# EAGLE design WirelessPowerRxExtensionBoard (EAGLE 6.4)

## Sheet 1 of 2
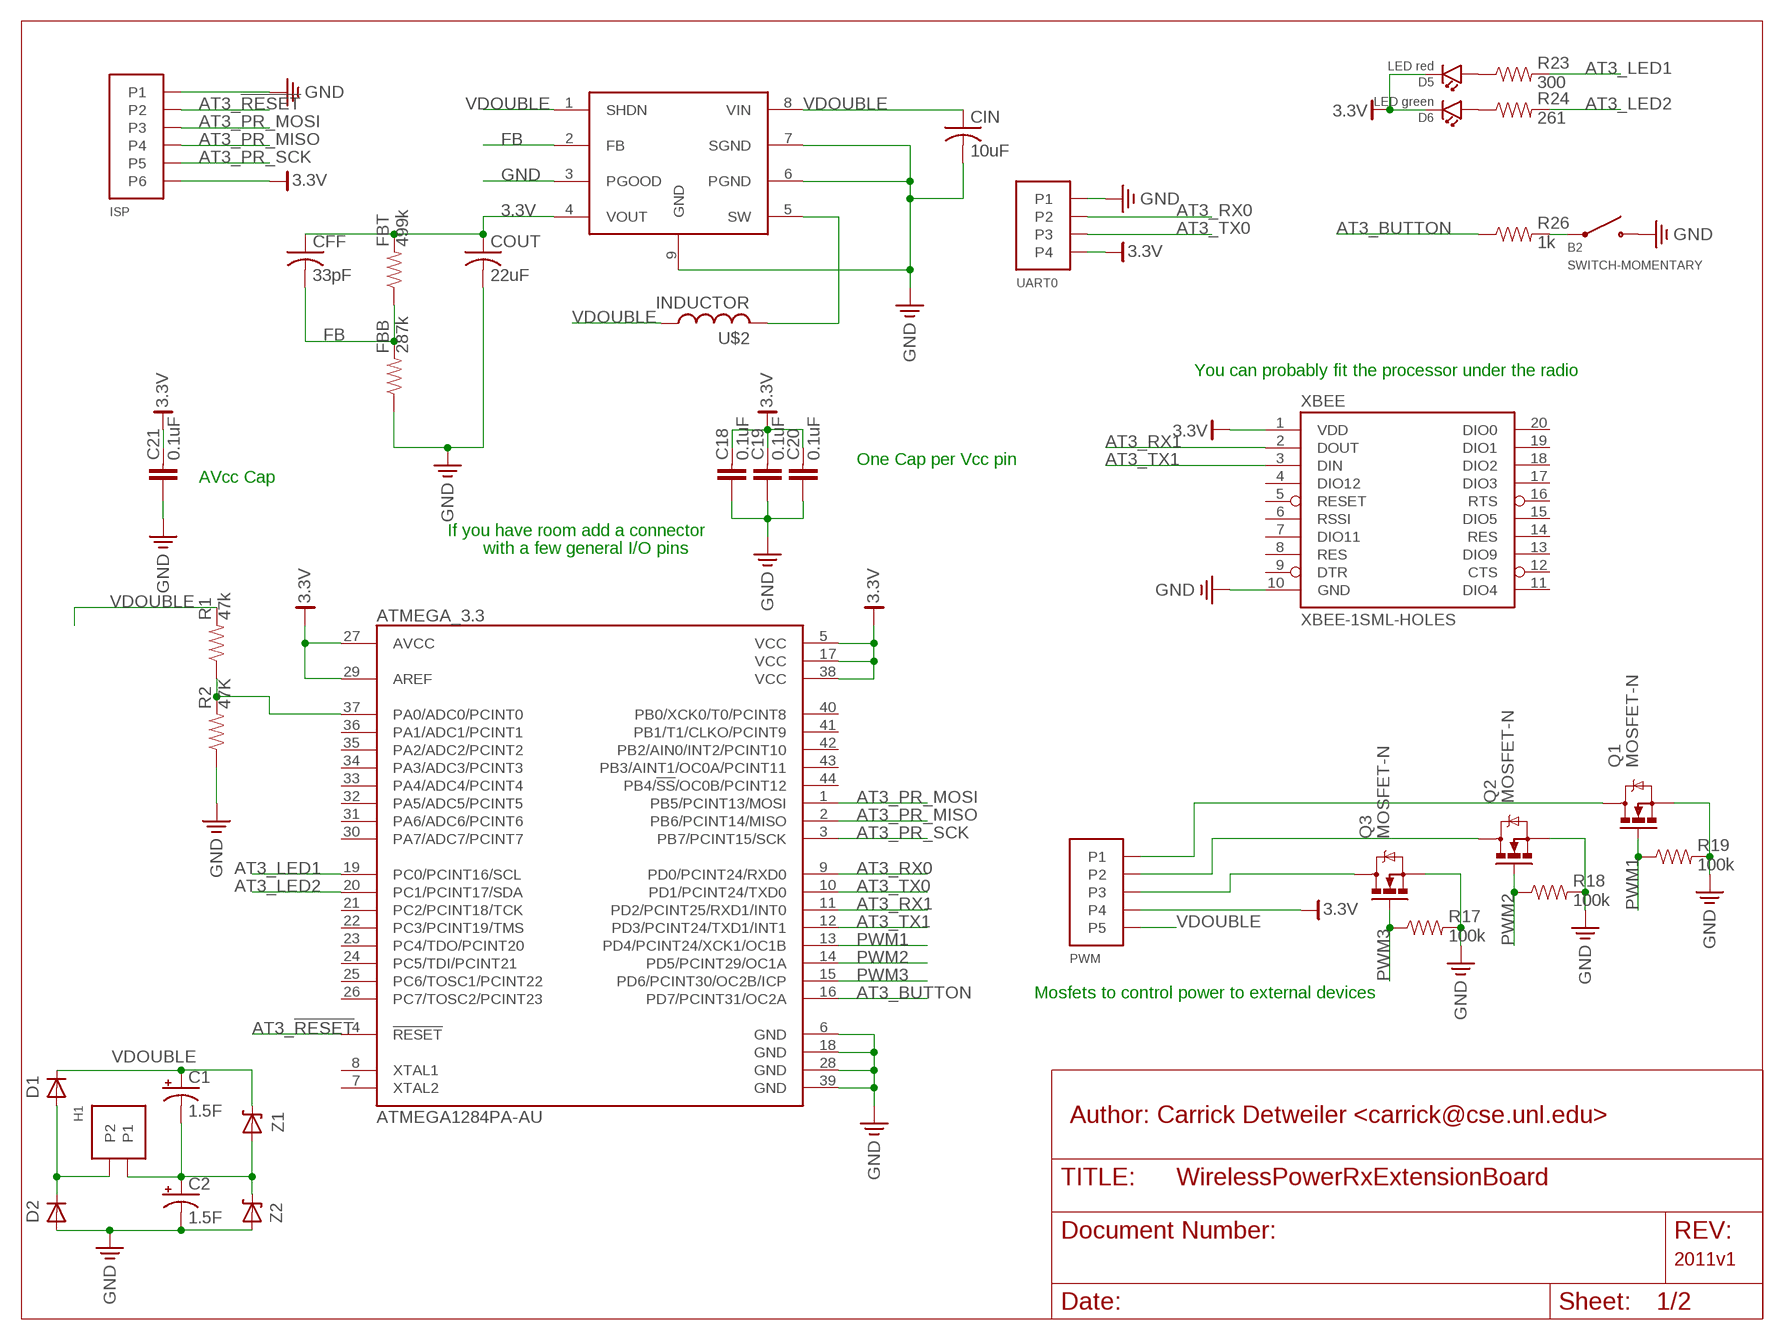
[diagram p0: schematic, sheet 1]

### Parts
ATMEGA_3.3  ATMEGA1284PA-AU  ATMEGA164PA-AU  [AT_TQFP-44]
B2  SWITCH-MOMENTARY  [SWITCH-MOMENTARY-PTS635-SMD]
C1  1.5F  CPOL-USE5-10.5  [E5-10,5]
C2  1.5F  CPOL-USE5-10.5  [E5-10,5]
C18  0.1uF  CAP0603  [C0603]
C19  0.1uF  CAP0603  [C0603]
C20  0.1uF  CAP0603  [C0603]
C21  0.1uF  CAP0603  [C0603]
CFF  33pF  C-USC0201  [C0201]
CIN  10uF  C-USC0805  [C0805]
COUT  22uF  C-USC0805  [C0805]
D1  DIODE  [DO-214AB]
D2  DIODE  [DO-214AB]
D5  LED red  LED  [LED0603]
D6  LED green  LED  [LED0603]
FBB  287k  RES0603  [R0603]
FBT  499k  RES0603  [R0603]
H1  DF3-2  [DF3-2]
ISP  DF3-6  [DF3-6]
PWM  DF3-5  [DF3-5]
Q1  MOSFET-N  [SOT-23]
Q2  MOSFET-N  [SOT-23]
Q3  MOSFET-N  [SOT-23]
R1  47k  RES0603  [R0603]
R2  47K  RES0603  [R0603]
R17  100k  RES0603  [R0603]
R18  100k  RES0603  [R0603]
R19  100k  RES0603  [R0603]
R23  300  RES0603  [R0603]
R24  261  RES0603  [R0603]
R26  1k  RES0603  [R0603]
U$1  STEPUPCONVERTER  [LTC3528/LTC3528B]
U$2  INDUCTOR  [WE-TPC-M]
UART0  DF3-4  [DF3-4]
XBEE  XBEE-1SML-HOLES  [XBEE-SML-HOLES]
Z1  ZENERDIODE  [SOD-123]
Z2  ZENERDIODE  [SOD-123]

### Nets
3.3V: ATMEGA_3.3.5(VCC) ATMEGA_3.3.17(VCC) ATMEGA_3.3.27(AVCC) ATMEGA_3.3.29(AREF) ATMEGA_3.3.38(VCC) C18.P$2 C19.P$2 C20.P$2 C21.P$2 CFF.1 COUT.1 D5.P$2 D6.P$2 FBT.P$2 ISP.P$6(P6) PWM.P$4(P4) U$1.4(VOUT) UART0.P$4(P4) XBEE.1(VDD)
AT3_!RESET!: ATMEGA_3.3.4(!RESET!) ISP.P$2(P2)
AT3_BUTTON: ATMEGA_3.3.16(PD7/PCINT31/OC2A) R26.P$1
AT3_LED1: ATMEGA_3.3.19(PC0/PCINT16/SCL) R23.P$2
AT3_LED2: ATMEGA_3.3.20(PC1/PCINT17/SDA) R24.P$2
AT3_PR_MISO: ATMEGA_3.3.2(PB6/PCINT14/MISO) ISP.P$4(P4)
AT3_PR_MOSI: ATMEGA_3.3.1(PB5/PCINT13/MOSI) ISP.P$3(P3)
AT3_PR_SCK: ATMEGA_3.3.3(PB7/PCINT15/SCK) ISP.P$5(P5)
AT3_RX0: ATMEGA_3.3.9(PD0/PCINT24/RXD0) UART0.P$2(P2)
AT3_RX1: ATMEGA_3.3.11(PD2/PCINT25/RXD1/INT0) XBEE.2(DOUT)
AT3_TX0: ATMEGA_3.3.10(PD1/PCINT24/TXD0) UART0.P$3(P3)
AT3_TX1: ATMEGA_3.3.12(PD3/PCINT24/TXD1/INT1) XBEE.3(DIN)
FB: CFF.2 FBB.P$2 FBT.P$1 U$1.2(FB)
GND: ATMEGA_3.3.6(GND) ATMEGA_3.3.18(GND) ATMEGA_3.3.28(GND) ATMEGA_3.3.39(GND) B2.P$2 C2.- C18.P$1 C19.P$1 C20.P$1 C21.P$1 CIN.2 COUT.2 D2.P$2(A) FBB.P$1 ISP.P$1(P1) Q1.2(S) Q2.2(S) Q3.2(S) R2.P$1 R17.P$2 R18.P$2 R19.P$2 U$1.3(PGOOD) U$1.6(PGND) U$1.7(SGND) U$1.9(GND) UART0.P$1(P1) XBEE.10(GND) Z2.P$2(A)
N$1: D1.P$2(A) D2.P$1(C) H1.P$2(P2)
N$3: ATMEGA_3.3.37(PA0/ADC0/PCINT0) R1.P$1 R2.P$2
N$4: C1.- C2.+ H1.P$1(P1) Z1.P$2(A) Z2.P$1(C)
N$20: PWM.P$3(P3) Q3.3(D)
N$22: PWM.P$2(P2) Q2.3(D)
N$23: B2.P$1 R26.P$2
N$24: PWM.P$1(P1) Q1.3(D)
N$38: D5.P$1 R23.P$1
N$39: D6.P$1 R24.P$1
PWM1: ATMEGA_3.3.13(PD4/PCINT24/XCK1/OC1B) Q1.1(G) R19.P$1
PWM2: ATMEGA_3.3.14(PD5/PCINT29/OC1A) Q2.1(G) R18.P$1
PWM3: ATMEGA_3.3.15(PD6/PCINT30/OC2B/ICP) Q3.1(G) R17.P$1
SW: U$1.5(SW) U$2.P$2
VDOUBLE: C1.+ CIN.1 D1.P$1(C) PWM.P$5(P5) R1.P$2 U$1.1(SHDN) U$1.8(VIN) U$2.P$1 Z1.P$1(C)
Unconnected: ATMEGA_3.3.7(XTAL2) ATMEGA_3.3.8(XTAL1) ATMEGA_3.3.21(PC2/PCINT18/TCK) ATMEGA_3.3.22(PC3/PCINT19/TMS) ATMEGA_3.3.23(PC4/TDO/PCINT20) ATMEGA_3.3.24(PC5/TDI/PCINT21) ATMEGA_3.3.25(PC6/TOSC1/PCINT22) ATMEGA_3.3.26(PC7/TOSC2/PCINT23) ATMEGA_3.3.30(PA7/ADC7/PCINT7) ATMEGA_3.3.31(PA6/ADC6/PCINT6) ATMEGA_3.3.32(PA5/ADC5/PCINT5) ATMEGA_3.3.33(PA4/ADC4/PCINT4) ATMEGA_3.3.34(PA3/ADC3/PCINT3) ATMEGA_3.3.35(PA2/ADC2/PCINT2) ATMEGA_3.3.36(PA1/ADC1/PCINT1) ATMEGA_3.3.40(PB0/XCK0/T0/PCINT8) ATMEGA_3.3.41(PB1/T1/CLKO/PCINT9) ATMEGA_3.3.42(PB2/AIN0/INT2/PCINT10) ATMEGA_3.3.43(PB3/AINT1/OC0A/PCINT11) ATMEGA_3.3.44(PB4/!SS!/OC0B/PCINT12) XBEE.4(DIO12) XBEE.5(RESET) XBEE.6(RSSI) XBEE.7(DIO11) XBEE.8(RES) XBEE.9(DTR) XBEE.11(DIO4) XBEE.12(CTS) XBEE.13(DIO9) XBEE.14(RES) XBEE.15(DIO5) XBEE.16(RTS) XBEE.17(DIO3) XBEE.18(DIO2) XBEE.19(DIO1) XBEE.20(DIO0)

### Notes on the sheet
- You can probably fit the processor under the radio
- One Cap per Vcc pin
- AVcc Cap
- If you have room add a connector
- with a few general I/O pins
- Mosfets to control power to external devices
- Author: Carrick Detweiler <carrick@cse.unl.edu>
- 2011v1

## Sheet 2 of 2
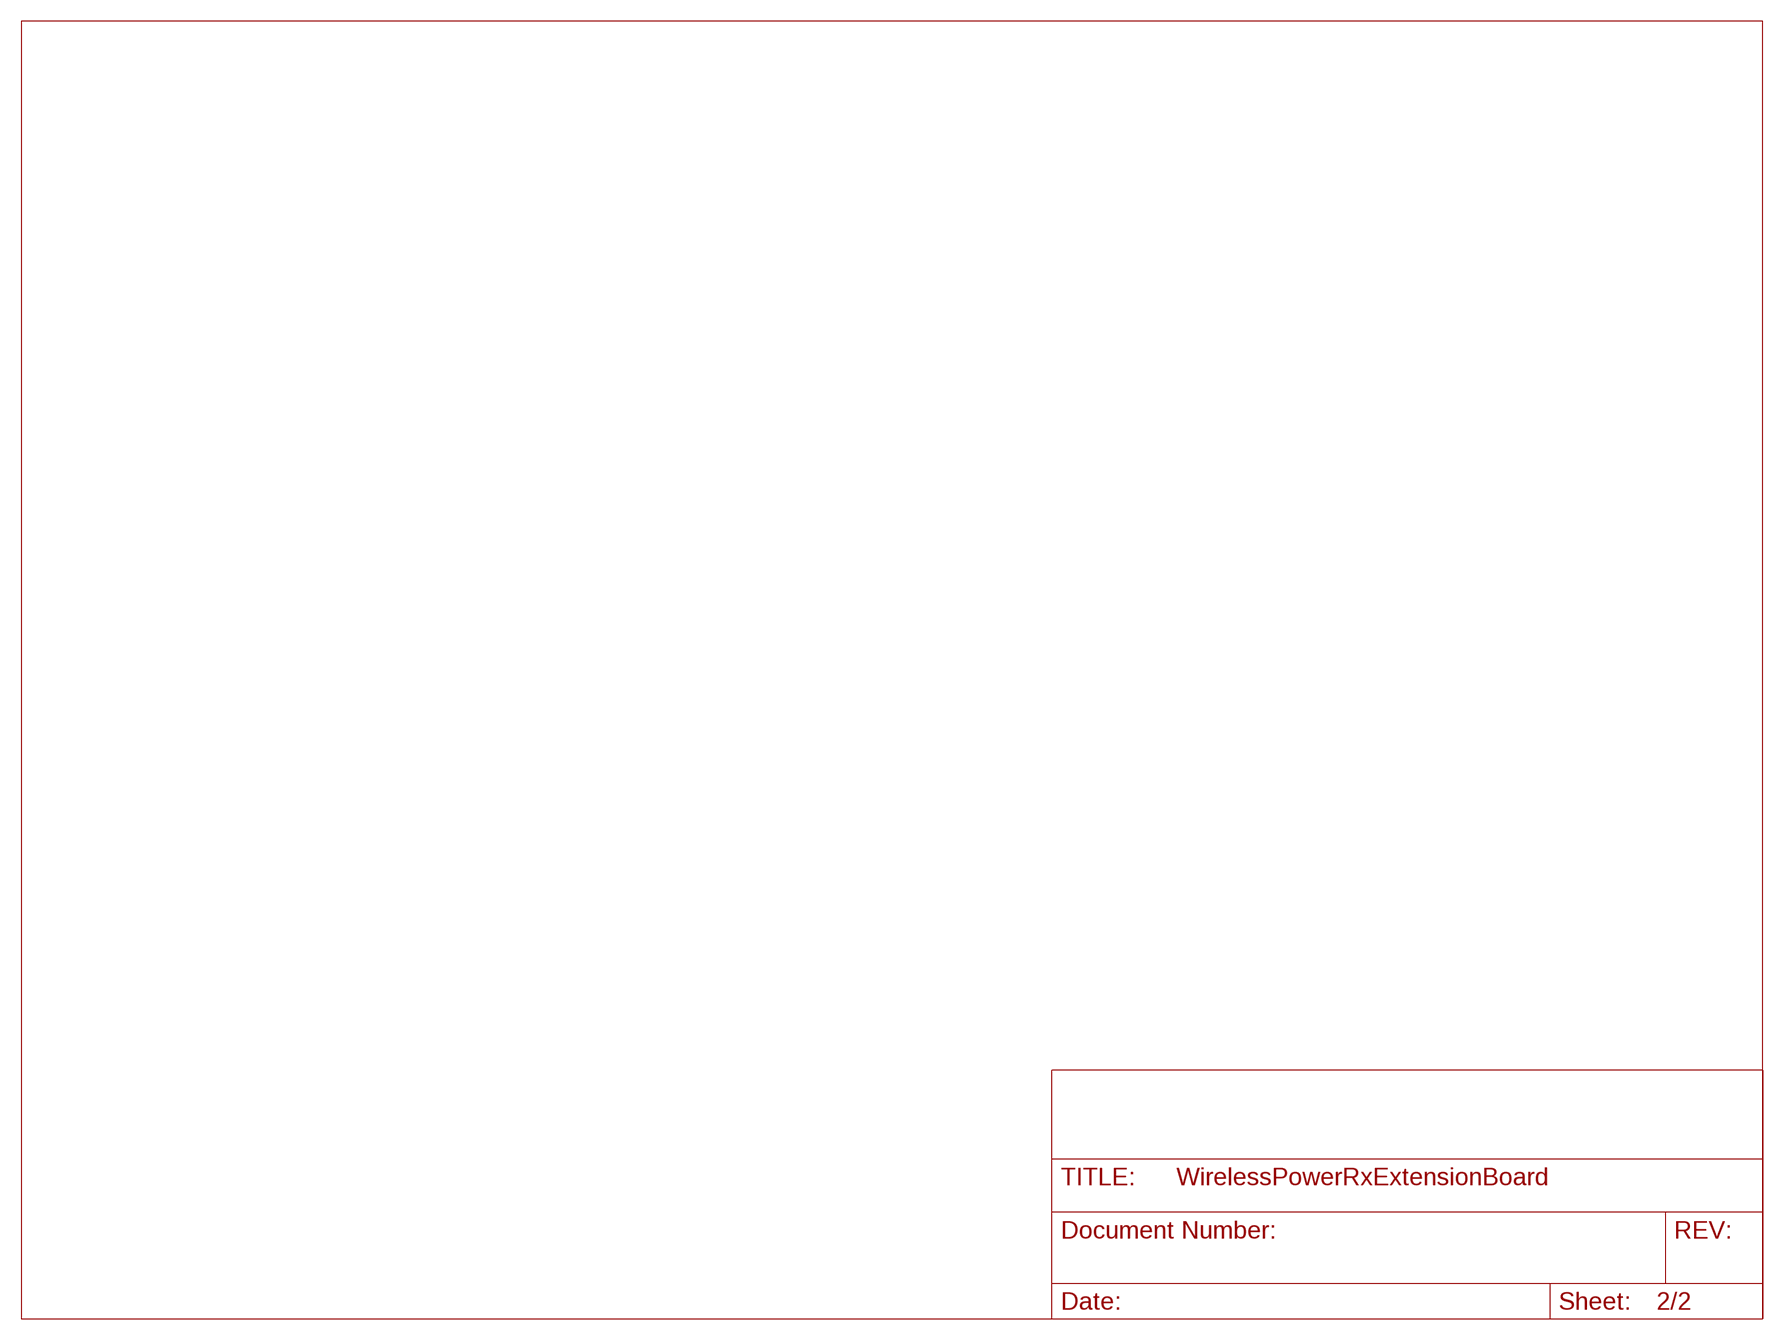
[diagram p1: schematic, sheet 2]

## Library data of the parts
ATMEGA_3.3 = kwgilpin:ATMEGA164: 8-bit AVR Microcontroller with 16K Flash; DIGIKEYPN: ATMEGA164P-20AU-ND; VENDOR: Digikey; VENDORPN: ATMEGA164P-20AU-ND
B2 = 000_carrick:SWITCH-MOMENTARY
C1 C2 = resistor:CPOL-US: POLARIZED CAPACITOR, American symbol
C18-C21 = carrick:CAP: Surface mount capacitor, non-polarized
CFF CIN COUT = rcl:C-US: CAPACITOR, American symbol
D1 D2 = crawford:DIODE: Diode SSC54-E3/57T SCHOTTKY 5A 40V package DO-214AB
D5 = 000_carrick:LED: LED; DIGIKEY: 160-1181-1-ND
D6 = 000_carrick:LED: LED; DIGIKEY: 160-1435-1-ND
FBB FBT R1 R2 R17-R19 = carrick:RES: Resistor
H1 = hirose:DF3-2
ISP = hirose:DF3-6
PWM = hirose:DF3-5
Q1-Q3 = carrick:MOSFET-N: N-Channel MOSFET 0.22A, 50V, few ohm resistance, can be driven at 3.3V Digikey parts: BSS138 BSS138CT-ND
R23 R24 R26 = 000_carrick:RES: Resistor
U$1 = crawford:STEPUPCONVERTER: LTC3528/LTC2528B 1A 1MHz Synchronous Step-Up DC/DC Converters in 3mm x 2mm DFN Manufacturer: Linear Technology
U$2 = crawford:INDUCTOR: Manufacturer: Wurth Value: 3.0uH Current Rating: 2.2A DC Resistance: 45 mOhm Package: 2323 (SMC) Manufacturer part no. : 744052003 Digikey Part Number: 732-1029-1-ND
UART0 = hirose:DF3-4
XBEE = carrick:XBEE-1
Z1 Z2 = crawford:ZENERDIODE

## Board
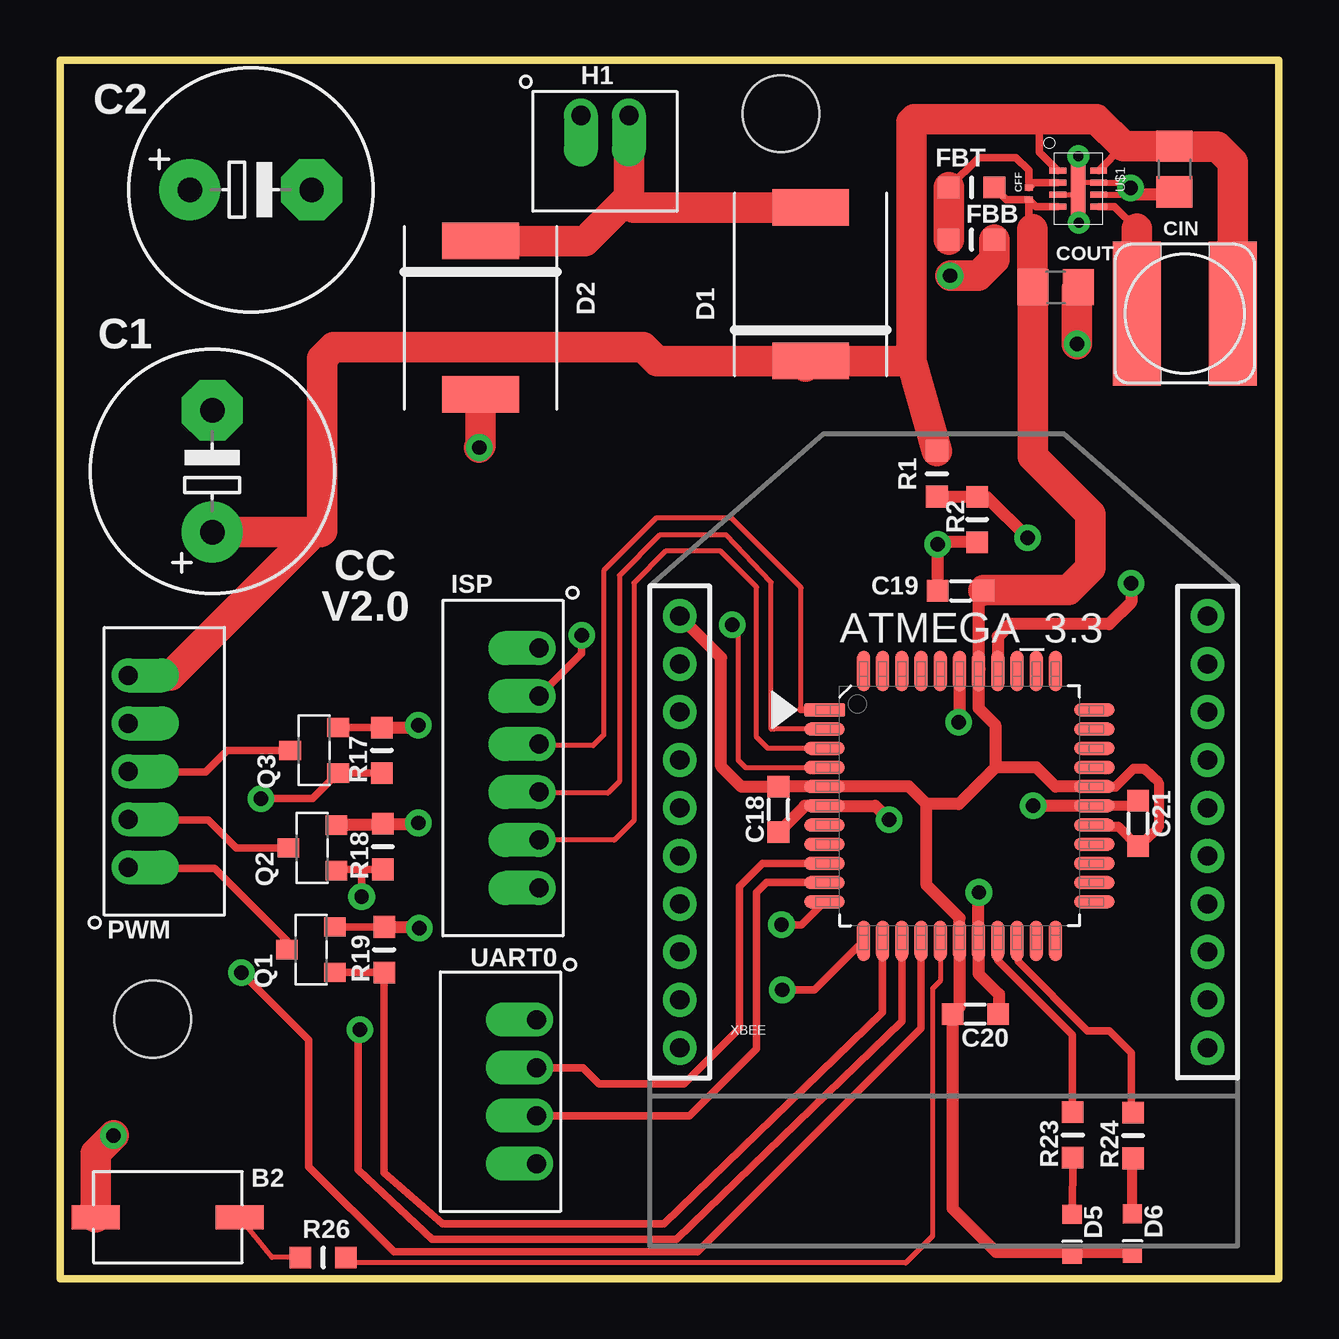
[diagram p2: board, top side]
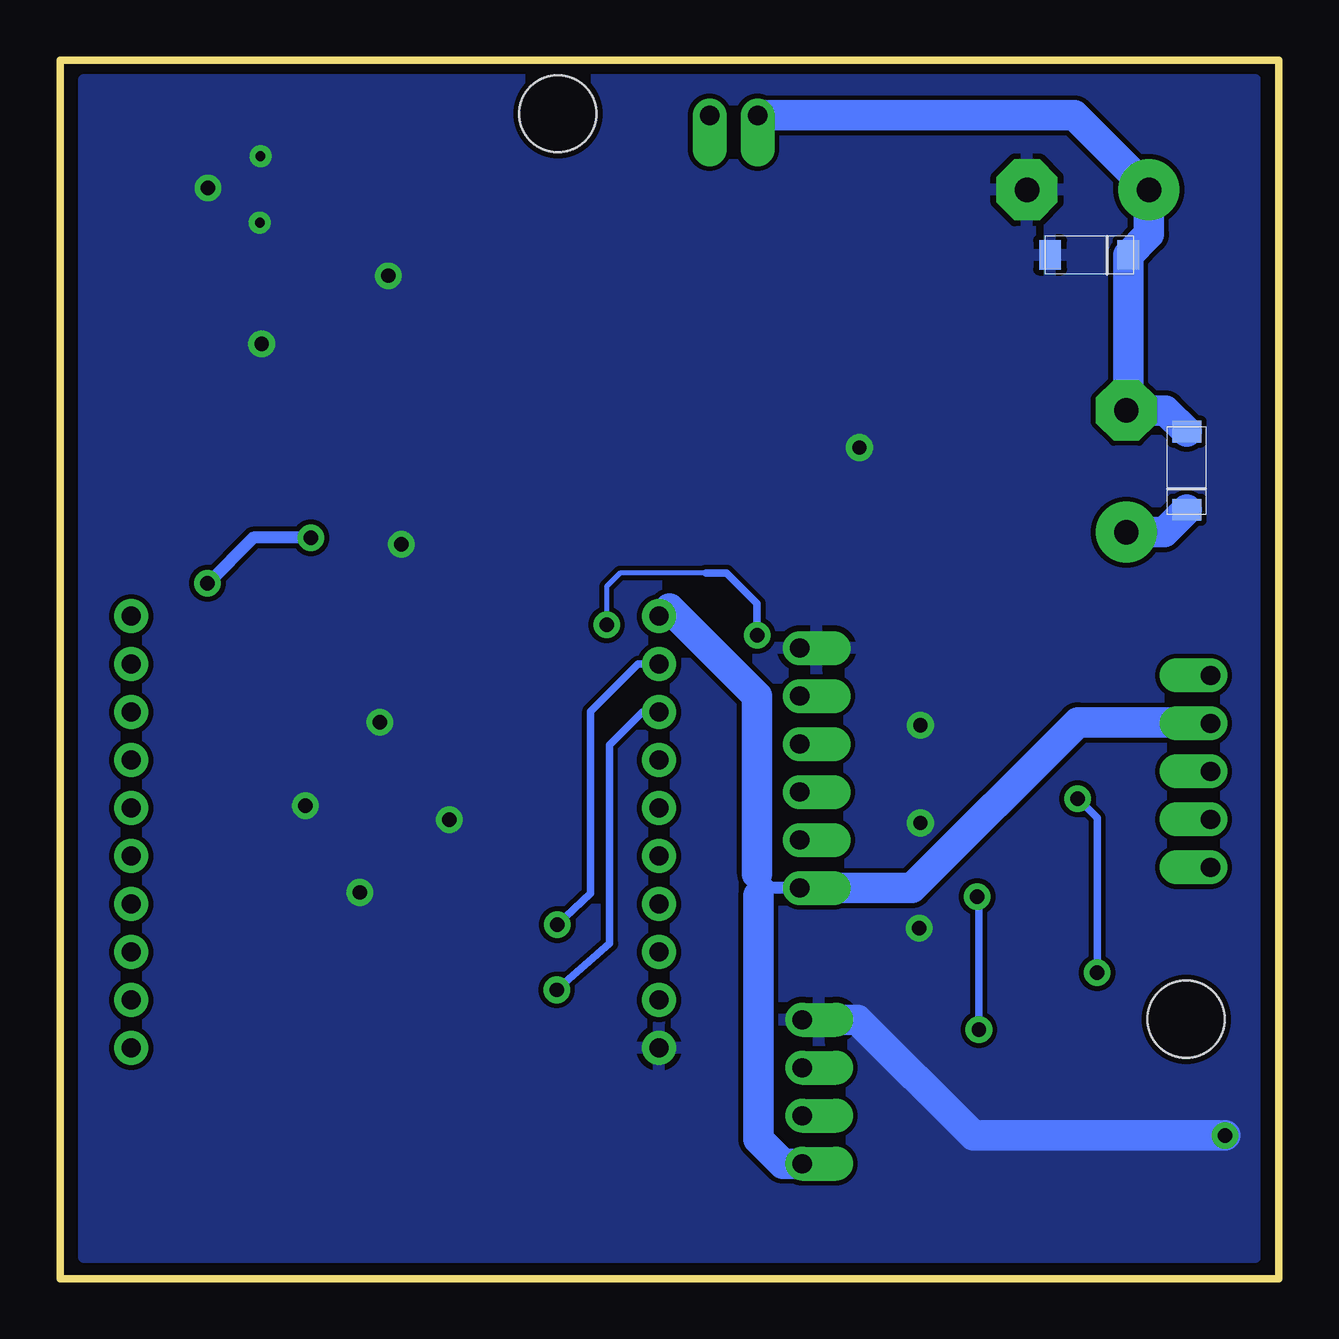
[diagram p3: board, bottom side, seen from below]

Size 50.8 x 50.8 mm. Coordinates in mm from the lower left corner, seen from the top.
Outline: 0,0 50.8,0 50.8,50.8 0,50.8 0,0
Copper layers (1*16): Top 0.035mm / dielectric 1.5mm / Bottom 0.035mm
Design rules "SparkFun": minimum track width 8mil, minimum drill 20mil, track to track 8mil, track to pad 8mil, pad to pad 8mil, via to via 8mil, smd to smd 8mil, copper to edge 10mil, drill to drill 8mil, minimum pad ring 12mil, minimum via ring 10mil, stop-mask expansion 4mil, vias tented up to drill 25mil, thermal gap 10mil
Holes 3.2 mm at 30.05,48.56 3.86,10.82

### Footprints (pad centres in the part's own frame; a part is rotated, then mirrored left to right if it is on the bottom)
AT_TQFP-44 = smd 1.7 x 0.55: 1 -5.625,4; 2 -5.625,3.2; 3 -5.625,2.4; 4 -5.625,1.6; 5 -5.625,0.8; 6 -5.625,0; 7 -5.625,-0.8; 8 -5.625,-1.6; 9 -5.625,-2.4; 10 -5.625,-3.2; 11 -5.625,-4; 23 5.625,-4; 24 5.625,-3.2; 25 5.625,-2.4; 26 5.625,-1.6; 27 5.625,-0.8; 28 5.625,0; 29 5.625,0.8; 30 5.625,1.6; 31 5.625,2.4; 32 5.625,3.2; 33 5.625,4 | smd 0.55 x 1.7: 12 -4,-5.625; 13 -3.2,-5.625; 14 -2.4,-5.625; 15 -1.6,-5.625; 16 -0.8,-5.625; 17 0,-5.625; 18 0.8,-5.625; 19 1.6,-5.625; 20 2.4,-5.625; 21 3.2,-5.625; 22 4,-5.625; 34 4,5.625; 35 3.2,5.625; 36 2.4,5.625; 37 1.6,5.625; 38 0.8,5.625; 39 0,5.625; 40 -0.8,5.625; 41 -1.6,5.625; 42 -2.4,5.625; 43 -3.2,5.625; 44 -4,5.625
SWITCH-MOMENTARY-PTS635-SMD = smd 2 x 1: P$1 -3,0; P$2 3,0
E5-10,5 = drill 1.016 pad 2.54: + -2.54,0 | drill 1.016 pad 2.54 octagon: - 2.54,0
C0603 = smd 0.9 x 0.9: P$1 -0.95,0; P$2 0.95,0
C0201 = smd 0.25 x 0.35: 1 -0.25,0; 2 0.25,0
C0805 = smd 1.3 x 1.5: 1 -0.95,0; 2 0.95,0
DO-214AB = smd 1.524 x 3.2: P$1 -3.2,0; P$2 3.2,0
LED0603 = smd 0.8 x 0.8: P$1 -0.825,0; P$2 0.825,0
R0603 = smd 0.9 x 0.9: P$1 -0.95,0; P$2 0.95,0
DF3-2 = drill 0.8 offset: P$1 0,0; P$2 -2,0
DF3-6 = drill 0.8 offset: P$1 0,0; P$2 -2,0; P$3 -4,0; P$4 -6,0; P$5 -8,0; P$6 -10,0
DF3-5 = drill 0.8 offset: P$1 0,0; P$2 -2,0; P$3 -4,0; P$4 -6,0; P$5 -8,0
SOT-23 = smd 0.8 x 0.9: 1 -0.95,-1; 2 0.95,-1; 3 0,1
LTC3528/LTC3528B = smd 0.25 x 0.7: 1 -0.75,-0.85; 2 -0.25,-0.85; 3 0.25,-0.85; 4 0.75,-0.85; 5 0.75,0.85; 6 0.25,0.85; 7 -0.25,0.85; 8 -0.75,0.85 | smd 2.2 x 0.61: 9 0,0
WE-TPC-M = smd 6 x 2: P$1 0,2; P$2 0,-2
DF3-4 = drill 0.8 offset: P$1 0,0; P$2 -2,0; P$3 -4,0; P$4 -6,0
XBEE-SML-HOLES = drill 0.8 pad 1.27: 1 -9.73,20; 2 -9.73,18; 3 -9.73,16; 4 -9.73,14; 5 -9.73,12; 6 -9.73,10; 7 -9.73,8; 8 -9.73,6; 9 -9.73,4; 10 -9.73,2; 11 12.27,2; 12 12.27,4; 13 12.27,6; 14 12.27,8; 15 12.27,10; 16 12.27,12; 17 12.27,14; 18 12.27,16; 19 12.27,18; 20 12.27,20
SOD-123 = smd 0.91 x 1.22: P$1 -1.63,0; P$2 1.63,0

### Placement (x,y rotation side)
ATMEGA_3.3  37.49,19.71 0 top
B2  4.5,2.57 180 top
C1  6.35,33.66 90 top
C2  7.95,45.39 0 top
C18  29.95,19.56 90 top
C19  37.54,28.68 0 top
C20  38.15,11.02 180 top
C21  44.93,18.97 270 top
CFF  40.39,45.24 90 top
CIN  46.46,46.25 270 top
COUT  41.5,41.33 0 top
D1  31.29,41.45 90 top
D2  17.53,40.06 270 top
D5  42.19,1.85 270 top
D6  44.7,1.88 270 top
FBB  38,43.31 180 top
FBT  38,45.49 0 top
H1  21.72,48.49 180 top
ISP  19.96,26.29 90 top
PWM  2.84,17.14 270 top
Q1  10.46,13.72 90 top
Q2  10.52,17.96 90 top
Q3  10.59,22.02 90 top
R1  36.55,33.55 90 top
R2  38.23,31.65 90 top
R17  13.41,22.02 90 top
R18  13.46,18.01 90 top
R19  13.51,13.72 90 top
R23  42.21,5.99 90 top
R24  44.73,5.97 90 top
R26  10.97,0.89 180 top
U$1  42.44,45.44 270 top
U$2  46.89,40.23 270 top
UART0  19.86,10.79 90 top
XBEE  35.56,7.62 0 top
Z1  3.84,33.68 90 bottom
Z2  7.9,42.67 180 bottom

### Tracks (layer width: path | path; a pad name or v marks a point on that pad's centre or on a via)
3.3V
  Top 0.305: CFF.1 40.68,44.69 U$1.4 | 40.54,43.74 40.39,43.89 CFF.1 | FBT.P$2 39.45,44.99 CFF.1
  Top 0.406: ATMEGA_3.3.29 44.01,20.51 44.76,21.26 45.19,21.26 45.8,20.68 45.8,18.81 C21.P$2 44.11,18.85 43.16,18.85 43.16,18.87 ATMEGA_3.3.27 | D6.P$2 42.22,1.05 D5.P$2
  Top 0.508: 38.33,25.4 ATMEGA_3.3.38 | XBEE.1 27.56,25.89 27.56,21.36 28.41,20.51 C18.P$2 ATMEGA_3.3.5 31.88,20.52 35.38,20.52 36.12,19.79 | 36.12,19.79 36.12,16.41 37.49,15.04 ATMEGA_3.3.17 37.49,11.31 C20.P$2 37.2,2.93 39.01,1.12 42.1,1.12 D5.P$2 | ATMEGA_3.3.38 38.29,23.79 38.99,23.09 38.99,21.31 | 38.99,21.31 37.47,19.79 36.12,19.79 | ATMEGA_3.3.29 41.49,20.51 40.69,21.31 38.99,21.31 | ATMEGA_3.3.38 38.29,28.48 C19.P$2 38.52,28.65 38.58,28.65
  Top 1.27: C19.P$2 38.52,28.7 42.04,28.7 42.95,29.62 42.95,31.88 40.55,34.27 COUT.1 40.54,41.34 40.54,43.74
  Bottom 0.203: 25.4,27.94 XBEE.1
  Bottom 0.508: 2.89,23.19 PWM.P$4 | ISP.P$6 21.17,16.29 21.27,16.4 | 21.27,16.4 21.74,16.87 | 21.69,15.98 21.27,16.4
  Bottom 1.27: ISP.P$6 15.28,16.29 8.38,23.19 2.89,23.19 | 21.74,16.87 21.74,24.28 25.4,27.94 | UART0.P$4 20.67,4.79 21.69,5.82 21.69,15.98
AT3_!RESET!  (via drill 0.6 pad 0.3)
  Top 0.203: v28.02,27.25 28.27,27 28.27,21.61 28.57,21.31 ATMEGA_3.3.4
  Top 0.305: v21.74,26.82 21.74,26.07 ISP.P$2
  Bottom 0.203: 23.88,29.41 27.46,29.41 28.02,28.85 v28.02,27.25
  Bottom 0.305: 23.88,29.41 23.01,29.41 21.74,28.14 v21.74,26.82
AT3_BUTTON
  Top 0.203: ATMEGA_3.3.16 36.69,12.41 36.37,12.09 36.37,1.78 35.26,0.66 12.15,0.66 R26.P$1
AT3_LED1
  Top 0.305: ATMEGA_3.3.19 39.09,13.26 42.19,10.16 42.19,6.97
  Top 0.406: 42.19,6.97 R23.P$2
AT3_LED2
  Top 0.305: ATMEGA_3.3.20 39.94,13.22 42.82,10.34 43.74,10.34 44.65,9.42 44.65,7 R24.P$2
  Top 0.406: 44.68,6.97 R24.P$2
AT3_PR_MISO
  Top 0.203: ATMEGA_3.3.2 29.74,22.91 29.64,22.91 29.64,29.03 27.79,30.99 24.99,30.99 23.32,29.31 23.32,20.73 22.84,20.24 20.01,20.24 ISP.P$4
AT3_PR_MOSI
  Top 0.203: 30.89,23.72 30.89,28.8 27.99,31.7 24.84,31.7 22.66,29.52 22.66,22.66 22.23,22.23 20.03,22.23 ISP.P$3
  Top 0.305: 30.89,23.72 ATMEGA_3.3.1
AT3_PR_SCK
  Top 0.203: ATMEGA_3.3.3 29.5,22.11 29.03,22.58 29.03,28.83 27.53,30.33 25.25,30.33 23.93,29.01 23.93,19.1 23.11,18.29 ISP.P$5
AT3_RX0
  Top 0.305: ATMEGA_3.3.9 29.29,17.31 28.32,16.34 28.32,10.44 26.01,8.13 22.48,8.13 21.81,8.79 UART0.P$2
AT3_RX1  (via drill 0.6)
  Top 0.305: ATMEGA_3.3.11 30.91,14.76 v30.07,14.76
  Bottom 0.305: v30.07,14.76 28.68,16.05 28.68,23.65 26.7,25.62 XBEE.2
AT3_TX0
  Top 0.305: ATMEGA_3.3.10 29.44,16.51 29.03,16.1 29.03,9.58 26.24,6.78 19.88,6.78 UART0.P$3
AT3_TX1  (via drill 0.6)
  Top 0.305: ATMEGA_3.3.12 31.45,12.04 v30.1,12.04
  Bottom 0.305: v30.1,12.04 27.89,13.97 27.89,22.25 26.52,23.62 XBEE.3
FB
  Top 0.305: U$1.2 40.59,45.69 CFF.2 40.39,46.2 39.85,46.74 38.29,46.74 FBT.P$1
  Top 1.27: FBT.P$1 FBB.P$2
GND  (via drill 0.41, 0.6)
  Top 0.203: U$1.7 42.69,45.69 U$1.9 42.19,45.19 U$1.3 | 1.49,2.57 B2.P$2
  Top 0.254: U$1.7 44.4,45.69 v44.63,45.47 44.35,45.19 U$1.6
  Top 0.305: R17.P$2 Q3.2 | R19.P$2 Q1.2
  Top 0.406: C21.P$1 44.72,19.71 ATMEGA_3.3.28
  Top 0.508: CIN.2 46.46,45.19 44.91,45.19 v44.63,45.47 | 13.53,14.68 R19.P$2 14.93,14.67 v14.99,14.61 | Q2.2 13.41,18.91 R18.P$2 14.89,18.96 v14.94,19 | C18.P$1 31.05,19.71 ATMEGA_3.3.6 33.98,19.71 v34.57,19.13 | v38.3,16.1 v38.29,16.09 ATMEGA_3.3.18 38.29,12.71 39.14,11.86 39.14,11.06 C20.P$1 | ATMEGA_3.3.28 v40.56,19.71 | ATMEGA_3.3.39 37.49,23.22 v37.47,23.19 | 36.68,28.65 36.65,28.68 C19.P$1 36.59,30.59 v36.58,30.61 36.67,30.7 R2.P$1 | R17.P$2 14.84,22.97 v14.94,23.06
  Top 1.27: COUT.2 42.39,41.27 v42.39,38.96 | B2.P$2 1.5,5.23 v2.23,5.97 | D2.P$2 17.53,34.72 v17.48,34.65 | FBB.P$1 38.95,42.48 38.28,41.81 v37.11,41.81
  Bottom 1.27: v2.23,5.97 12.72,5.97 17.55,10.79 UART0.P$1
  other vias: 42.44,46.79 42.47,44.02
  pour Bottom: 0.99,49.96 49.81,49.96 49.81,0.91 0.99,0.91
N$1
  Top 1.27: D2.P$1 21.89,43.26 23.6,44.96 | 23.6,44.96 23.72,45.09 H1.P$2 | D1.P$2 23.9,44.65 23.6,44.96
N$3  (via drill 0.6)
  Top 0.508: R1.P$1 R2.P$2 38.62,32.6 v40.34,30.89 | v44.65,28.98 44.65,28.19 43.74,27.28 39.6,27.28 39.09,26.77 ATMEGA_3.3.37
  Bottom 0.508: v40.34,30.89 42.75,30.89 v44.65,28.98
N$4
  Bottom 1.27: Z1.P$2 4.72,36.2 C1.- 6.27,36.28 Z2.P$1 5.41,43.53 C2.+ 8.51,48.49 H1.P$1
N$20
  Top 0.305: Q3.3 6.96,22.02 6.07,21.13 2.86,21.13 PWM.P$3
N$22
  Top 0.305: Q2.3 7.34,17.96 6.17,19.13 2.86,19.13 PWM.P$2
N$23
  Top 0.203: R26.P$2 8.84,0.89 B2.P$1
N$24
  Top 0.305: Q1.3 9.46,14.08 6.45,17.09 2.9,17.09 PWM.P$1
N$38
  Top 0.305: R23.P$1 D5.P$1
N$39
  Top 0.406: D6.P$1 44.7,4.99 R24.P$1
PWM1
  Top 0.305: Q1.1 R19.P$1 13.51,4.42 15.95,2.29 25.17,2.29 34.29,11.1 ATMEGA_3.3.13
PWM2  (via drill 0.6)
  Top 0.305: R18.P$1 12.75,17.06 | 12.75,17.06 11.57,17.06 Q2.1 | ATMEGA_3.3.14 35.09,10.73 25.7,1.65 15.52,1.65 12.42,4.55 12.42,10.31 v12.5,10.39 | v12.57,15.93 12.57,16.88 12.75,17.06
  Bottom 0.305: v12.5,10.39 12.5,15.85 v12.57,15.93
PWM3  (via drill 0.6)
  Top 0.305: R17.P$1 Q3.1 10.54,20.02 v8.38,20.02 | ATMEGA_3.3.15 35.89,10.44 26.57,1.12 13.92,1.12 10.36,4.67 10.36,9.96 v7.57,12.75
  Bottom 0.305: v7.57,12.75 7.57,19.2 v8.38,20.02
SW
  Top 0.305: U$1.5 43.95,44.69 44.88,43.76
  Top 1.27: U$2.P$2 44.89,43.76 44.88,43.76
VDOUBLE
  Top 0.305: U$1.1 40.82,46.97 40.82,48.34 | U$1.8 44.31,47.2 44.34,47.2
  Top 1.27: C1.+ 10.59,31.11 | 10.59,31.11 10.87,31.11 10.92,31.17 10.92,38.35 11.4,38.84 24.31,38.84 24.89,38.25 D1.P$1 | 31.06,38.02 D1.P$1 | U$2.P$1 48.89,46.54 48.23,47.19 CIN.1 44.34,47.2 43.2,48.34 40.82,48.34 35.61,48.34 35.48,48.21 35.48,38.25 | 35.48,38.25 D1.P$1 | PWM.P$5 4.62,25.14 10.59,31.11 | 35.48,38.25 R1.P$2
  Bottom 1.27: Z1.P$1 4.77,31.11 C1.+

### Text on the board
tNames: CC | V2.0